# Altium schematic sheet as14120_x31_fpga_ttl.SchDoc
size A3; PageSetup: Record=PageOptions|CenterHorizontal=True|CenterVertical=True|PrintScale=1.05|XCorrection=1.00|YCorrection=1.00|PrintKind=1|BorderSize=5000000|LeftOffset=0|BottomOffset=0|Orientation=2|PaperLength=4290|PaperWidth=3060|Scale=100|PaperSource=7|PrintQuality=-4|MediaType=1|DitherType=10|PaperKind=A3 (без полей / бумага продольной резки) (297 x 420 мм)|PrintScaleMode=1
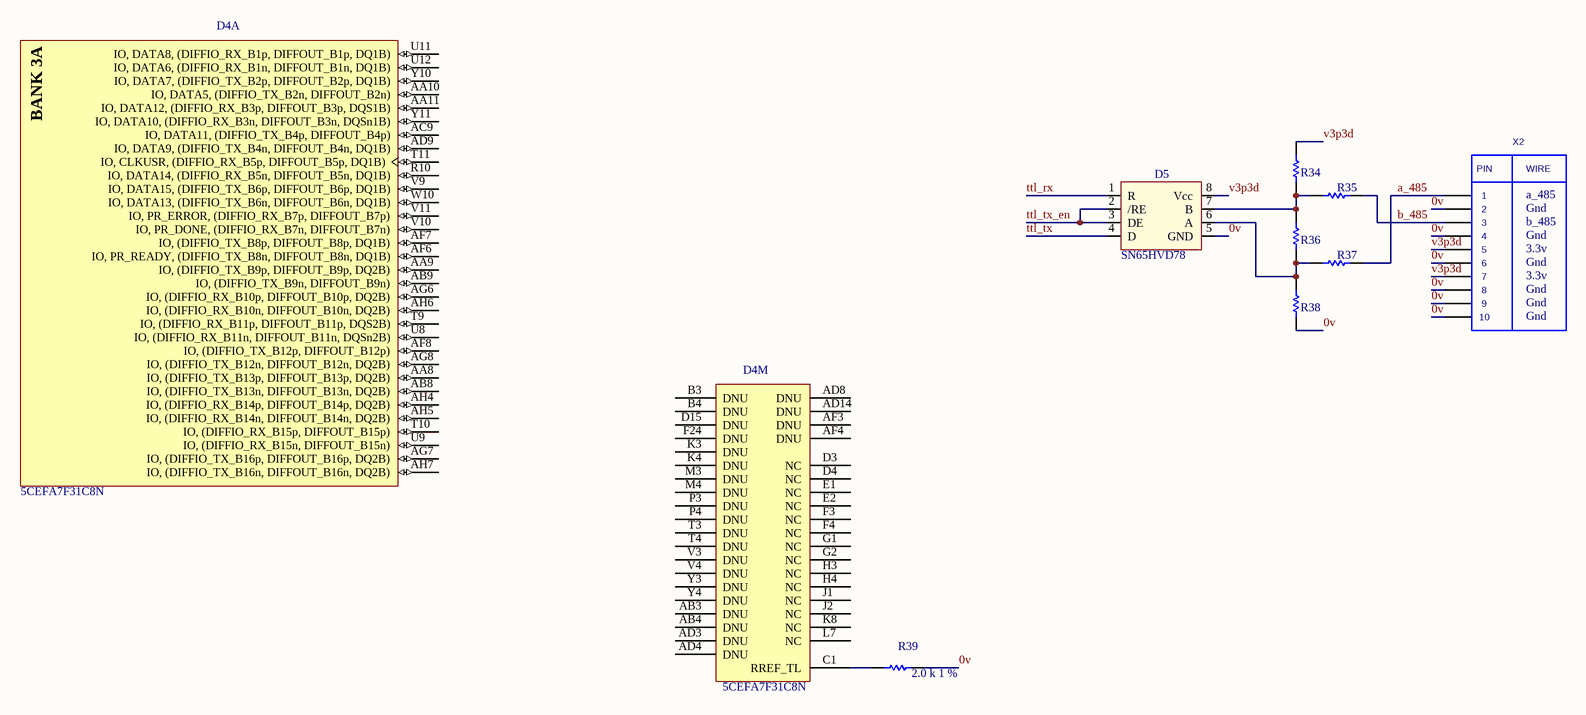
[diagram p0: as14120_x31_fpga_ttl.SchDoc]

## Parts
D4  5CEFA7F31C8N  [ALTR-896-FBGA-2000A]  (parts A,M of 13)
D5  SN65HVD78  [8S1_M]
R34  1K 1% 0805(2012)  [RESC0805(2012)_L]  (value not drawn)
R35  1K 1% 0805(2012)  [RESC0805(2012)_L]  (value not drawn)
R36  1K 1% 0805(2012)  [RESC0805(2012)_L]  (value not drawn)
R37  1K 1% 0805(2012)  [RESC0805(2012)_L]  (value not drawn)
R38  1K 1% 0805(2012)  [RESC0805(2012)_L]  (value not drawn)
R39  value 2.0 k  Tolerance: 1 %  [RESC0805(2012)_L]  (hidden comment: 1K 1% 0805(2012))
X2  IDC10  [IDC10M]  (value not drawn)

## Nets
0v: D5.5(GND) R38.1 R39.2 X2.2 X2.4 X2.6 X2.8 X2.9 X2.10
a_485: R37.2 X2.1
b_485: R35.2 X2.3
ttl_rx: D5.1(R)
ttl_tx: D5.4(D)
ttl_tx_en: D5.2(/RE) D5.3(DE)
v3p3d: D5.8(Vcc) R34.2 X2.5 X2.7
NetD4_C1: D4.C1(RREF_TL) R39.1
NetD5_6: D5.6(A) R36.1 R37.1 R38.2
NetD5_7: D5.7(B) R34.1 R35.1 R36.2

Not connected (* = marked no-connect by the designer): D4 AA8(IO,_(DIFFIO_TX_B13p,_DIFFOUT_B13p,_DQ2B)) AA9(IO,_(DIFFIO_TX_B9p,_DIFFOUT_B9p,_DQ2B)) AA10(IO,_DATA5,_(DIFFIO_TX_B2n,_DIFFOUT_B2n)) AA11(IO,_DATA12,_(DIFFIO_RX_B3p,_DIFFOUT_B3p,_DQS1B)) AB3(DNU) AB4(DNU) AB8(IO,_(DIFFIO_TX_B13n,_DIFFOUT_B13n,_DQ2B)) AB9(IO,_(DIFFIO_TX_B9n,_DIFFOUT_B9n)) AC9(IO,_DATA11,_(DIFFIO_TX_B4p,_DIFFOUT_B4p)) AD3(DNU) AD4(DNU) AD8(DNU) AD9(IO,_DATA9,_(DIFFIO_TX_B4n,_DIFFOUT_B4n,_DQ1B)) AD14(DNU) AF3(DNU) AF4(DNU) AF6(IO,_PR_READY,_(DIFFIO_TX_B8n,_DIFFOUT_B8n,_DQ1B)) AF7(IO,_(DIFFIO_TX_B8p,_DIFFOUT_B8p,_DQ1B)) AF8(IO,_(DIFFIO_TX_B12p,_DIFFOUT_B12p)) AG6(IO,_(DIFFIO_RX_B10p,_DIFFOUT_B10p,_DQ2B)) AG7(IO,_(DIFFIO_TX_B16p,_DIFFOUT_B16p,_DQ2B)) AG8(IO,_(DIFFIO_TX_B12n,_DIFFOUT_B12n,_DQ2B)) AH4(IO,_(DIFFIO_RX_B14p,_DIFFOUT_B14p,_DQ2B)) AH5(IO,_(DIFFIO_RX_B14n,_DIFFOUT_B14n,_DQ2B)) AH6(IO,_(DIFFIO_RX_B10n,_DIFFOUT_B10n,_DQ2B)) AH7(IO,_(DIFFIO_TX_B16n,_DIFFOUT_B16n,_DQ2B)) B3(DNU) B4(DNU) D3(NC) D4(NC) D15(DNU) E1(NC) E2(NC) F3(NC) F4(NC) F24(DNU) G1(NC) G2(NC) H3(NC) H4(NC) J1(NC) J2(NC) K3(DNU) K4(DNU) K8(NC) L7(NC) M3(DNU) M4(DNU) P3(DNU) P4(DNU) R10(IO,_DATA14,_(DIFFIO_RX_B5n,_DIFFOUT_B5n,_DQ1B)) T3(DNU) T4(DNU) T9(IO,_(DIFFIO_RX_B11p,_DIFFOUT_B11p,_DQS2B)) T10(IO,_(DIFFIO_RX_B15p,_DIFFOUT_B15p)) T11(IO,_CLKUSR,_(DIFFIO_RX_B5p,_DIFFOUT_B5p,_DQ1B)) U8(IO,_(DIFFIO_RX_B11n,_DIFFOUT_B11n,_DQSn2B)) U9(IO,_(DIFFIO_RX_B15n,_DIFFOUT_B15n)) U11(IO,_DATA8,_(DIFFIO_RX_B1p,_DIFFOUT_B1p,_DQ1B)) U12(IO,_DATA6,_(DIFFIO_RX_B1n,_DIFFOUT_B1n,_DQ1B)) V3(DNU) V4(DNU) V9(IO,_DATA15,_(DIFFIO_TX_B6p,_DIFFOUT_B6p,_DQ1B)) V10(IO,_PR_DONE,_(DIFFIO_RX_B7n,_DIFFOUT_B7n)) V11(IO,_PR_ERROR,_(DIFFIO_RX_B7p,_DIFFOUT_B7p)) W10(IO,_DATA13,_(DIFFIO_TX_B6n,_DIFFOUT_B6n,_DQ1B)) Y3(DNU) Y4(DNU) Y10(IO,_DATA7,_(DIFFIO_TX_B2p,_DIFFOUT_B2p,_DQ1B)) Y11(IO,_DATA10,_(DIFFIO_RX_B3n,_DIFFOUT_B3n,_DQSn1B))

## Notes on the sheet
- a_485
- b_485
- 3.3v
- Gnd
- Title
- Size:
- Date:
- A3
- Number:
- Time:
- Revision:
- Sheet
- of
- File:
- (in symbol 5CEFA7F31C8N, part A) BANK 3A
- (in symbol IDC10) PIN; WIRE

## Library data of the parts
D4 = 5CEFA7F31C8N: Cyclone V E Family FPGA, 1.07 to 1.13 V Supply, 480 I/O Pins, 7 PLLs, 896-Pin FBGA, Speed Grade 8, Commercial Grade, RoHS Compliant; Manufacturer: Altera; Device Group: 5CEFA7; GPIO: 480; Logic Elements (LE) (K): 149.5; Speed Grade: 8; DatasheetVersion: Rev. 3.1; PackageReference: 896-FBGA-2000A; PackageDescription: 896-Pin FineLine Ball-Grid Array (FBGA), Body 31 x 31 mm, Pitch 1 mm; Supplier 1: Digi-Key; Supplier Part Number 1: 544-2768-ND; Supplier 2: Mouser; Supplier Part Number 2: 989-5CEFA7F31C8N; RoHS: RoHS Compliant; Subcategory: Cyclone V E; Voltage Supply: 1.07 to 1.13 V; Mounting Technology: Surface Mount; Code_JEDEC: MS-034-AAN-1; PartNumber: 5CEFA7F31C8N; ComponentLink1Description: Manufacturer URL; ComponentLink1URL: http://www.altera.com; ComponentLink2Description: Datasheet; ComponentLink2URL: http://www.altera.com/literature/hb/cyclone-v/cv_51002.pdf; ComponentLink3Description: Package Specification; ComponentLink3URL: http://www.altera.com/devicepackaging/04R00435-01.pdf; ComponentLink4Description: Device Handbook URL; ComponentLink4URL: http://www.altera.com/literature/hb/cyclone-v/cyclone5_handbook.pdf; ComponentLink5Description: Device Overview URL; ComponentLink5URL: http://www.altera.com/literature/hb/cyclone-v/cv_51001.pdf; ComponentLink6Description: Device Pin-Out URL; ComponentLink6URL: http://www.altera.com/literature/dp/cyclone-v/1.1.txt; ComponentLink7Description: Product URL; ComponentLink7URL: http://www.buyaltera.com/scripts/partsearch.dll?Detail&name=5CEFA7F31C8N-ND
R34 R38 = RES_0805: 1K 0.125W 1% 0805 (2012 Metric)  SMD; Case-Metric: 2012; Value: 1.1 k; Case-EIA: 0805; Tolerance: 1 %; Power: 0.125 W; Technology: SMT
R35 R37 = RES_0805: 1K 0.125W 1% 0805 (2012 Metric)  SMD; Case-Metric: 2012; Value: 33; Case-EIA: 0805; Tolerance: 1 %; Power: 0.125 W; Technology: SMT
R36 = RES_0805: 1K 0.125W 1% 0805 (2012 Metric)  SMD; Case-Metric: 2012; Value: 120; Case-EIA: 0805; Tolerance: 1 %; Power: 0.125 W; Technology: SMT
R39 = RES_0805: 1K 0.125W 1% 0805 (2012 Metric)  SMD; Case-Metric: 2012; Case-EIA: 0805; Power: 0.125 W; Technology: SMT
X2 = IDC10: Value: *